# Altium schematic sheet IMU.SchDoc
size A; SheetNumber: 1; SheetTotal: 2
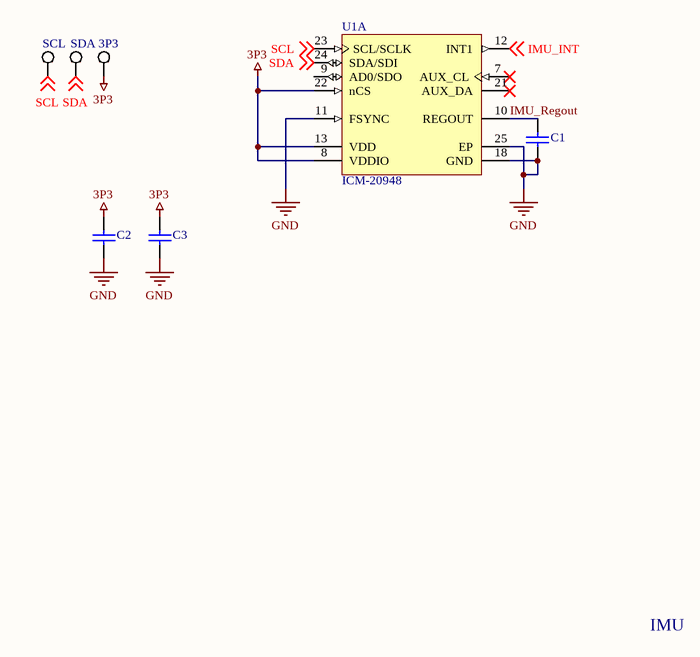
[diagram p0: IMU.SchDoc]

## Parts
3P3  5019  [KSTN-5019_V]  (value not drawn)
C1  GRM21BR71H104KA01L  [CAPC2013X135X45ML10T25]  (value not drawn)
C2  GRM21BR71H104KA01L  [CAPC2013X135X45ML10T25]  (value not drawn)
C3  GRM21BR71H104KA01L  [CAPC2013X135X45ML10T25]  (value not drawn)
SCL  5019  [KSTN-5019_V]  (value not drawn)
SDA  5019  [KSTN-5019_V]  (value not drawn)
U1  ICM-20948  [TDK-QFN-24_L]  (part A of 2)

## Nets
3P3: 3P3.1 C2.2 C3.2 U1.8(VDDIO) U1.13(VDD) U1.22(nCS)
GND: C1.1 C2.1 C3.1 U1.11(FSYNC) U1.18(GND) U1.25(EP)
IMU_INT: U1.12(INT1) ; off-sheet IMU_INT
IMU_Regout: C1.2 U1.10(REGOUT)
SCL: SCL.1 U1.23(SCL/SCLK) ; off-sheet SCL
SDA: SDA.1 U1.24(SDA/SDI) ; off-sheet SDA

Not connected (* = marked no-connect by the designer): U1 7(AUX_CL)* 9(AD0/SDO) 21(AUX_DA)*

## Notes on the sheet
- IMU

## Library data of the parts
3P3 SCL SDA = CMP-1672-00008-1: Test Point, 1 Position SMD, RoHS, Tape and Reel; ComponentLink1Description: Manufacturer URL; Package Quantity: 1000; DatasheetVersion: 03/2014; Packaging: Tape and Reel; ComponentLink2URL: http://www.keyelco.com/product-pdf.cfm?p=1357; ComponentLink1URL: http://www.keyelco.com/; Mount: Surface Mount; Contact Plating: Silver; PackageDescription: 1-Pin Surface Mount Device, Body 3.81 x 2.03 mm; Pins: 1; RoHSCompliant: True; Mounting Technology: Surface Mount; ComponentLink2Description: Datasheet; PackageReference: 5019
C1-C3 = CMP-2100-03644-1: Chip Capacitor, 0.1 uF, +/- 10%, 50 V, -55 to 125 degC, 0805 (2012 Metric), RoHS, Tape and Reel; Manufacturer: Murata; Voltage: 50V; Capacitance: 100nF; Insulation Resistance: 10GR; Dielectric Material: Ceramic; Dielectric: X7R; Package Description: 2-Pin Surface Mount Device, Body 2 x 1.25 mm; Manufacturer URL: http://www.murata.com/; Case Code (Imperial): 0805; Datasheet URL: http://psearch.en.murata.com/capacitor/product/GRM21BR71H104KA01%23.pdf; Termination: SMD/SMT; Lead Free: LeadFree; Package Quantity: 1; Mount: SurfaceMount; REACH SVHC: Unknown; Thickness: 0.053inch; Height: 1.25mm; Case/Package: 0805; Voltage Rating: 50V; Width: 0.049inch; Case Code (Metric): 2012; Material: Ceramic; Min Operating Temperature: -55degC; RoHSCompliant: true; Datasheet Version: 42675.0; Voltage Rating (DC): 50V; Tolerance: 10%; Package Reference: 0805; Depth: 1.25mm; Length: 2mm; Max Operating Temperature: 125degC; Packaging: TapeandReel; Number of Pins: 2; Radiation Hardening: No
U1 = CMP-2000-07532-1: World’s Lowest Power 9-Axis MEMS MotionTracking(TM) Device, 1.71 to 3.6 V, -40 to 85 degC, 24-Pin QFN, RoHS, Tape and Reel; Manufacturer: TDK; Package Description: 24-Pin Quad Flat No-lead Package, Body 3 x 3 mm, Pitch 0.4 mm; Datasheet Version: Rev. 1.3, 06/2017; Package Reference: QFN-24; Mounting Technology: SurfaceMount; Datasheet URL: https://www.invensense.com/wp-content/uploads/2016/06/DS-000189-ICM-20948-v1.3.pdf; Manufacturer URL: http://www.tdk.com/